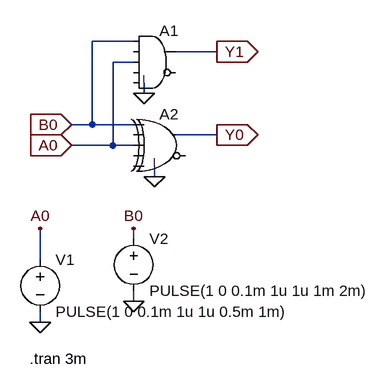
[diagram p0: schematic Fig_9-14_Half-adder.asc]
Fig_9-14_Half-adder.asc, the LTspice schematic file:
Version 4
SHEET 1 1000 680
WIRE 32 -80 -32 -80
WIRE 160 -64 96 -64
WIRE 32 -48 0 -48
WIRE 48 0 48 -16
WIRE -32 48 -32 -80
WIRE -32 48 -64 48
WIRE 32 48 -32 48
WIRE 160 64 96 64
WIRE 0 80 0 -48
WIRE 0 80 -64 80
WIRE 32 80 0 80
WIRE 64 128 64 112
WIRE 32 224 32 208
WIRE -112 256 -112 208
WIRE 32 320 32 304
WIRE -112 352 -112 336
FLAG 48 0 0
FLAG 64 128 0
FLAG -64 80 A0
IOPIN -64 80 In
FLAG -64 48 B0
IOPIN -64 48 In
FLAG 160 64 Y0
IOPIN 160 64 Out
FLAG 160 -64 Y1
IOPIN 160 -64 Out
FLAG 32 320 0
FLAG -112 352 0
FLAG -112 208 A0
FLAG 32 208 B0
SYMBOL Digital\\and 64 -112 R0
SYMATTR InstName A1
SYMBOL Digital\\xor 80 16 R0
SYMATTR InstName A2
SYMBOL voltage -112 240 R0
WINDOW 123 0 0 Left 2
WINDOW 39 0 0 Left 2
SYMATTR InstName V1
SYMATTR Value PULSE(1 0 0.1m 1u 1u 0.5m 1m)
SYMBOL voltage 32 208 R0
WINDOW 123 0 0 Left 2
WINDOW 39 0 0 Left 2
SYMATTR InstName V2
SYMATTR Value PULSE(1 0 0.1m 1u 1u 1m 2m)
TEXT -128 408 Left 2 !.tran 3m

The netlist it stands for:
* Fig_9-14_Half-adder.asc
A1 B0 0 A0 0 0 0 Y1 0 AND
A2 B0 0 A0 0 0 0 Y0 0 XOR
V1 A0 0 PULSE(1 0 0.1m 1u 1u 0.5m 1m)
V2 B0 0 PULSE(1 0 0.1m 1u 1u 1m 2m)
.tran 3m
.backanno
.end